# EAGLE design adafruit flora mainboard (EAGLE 6.3)
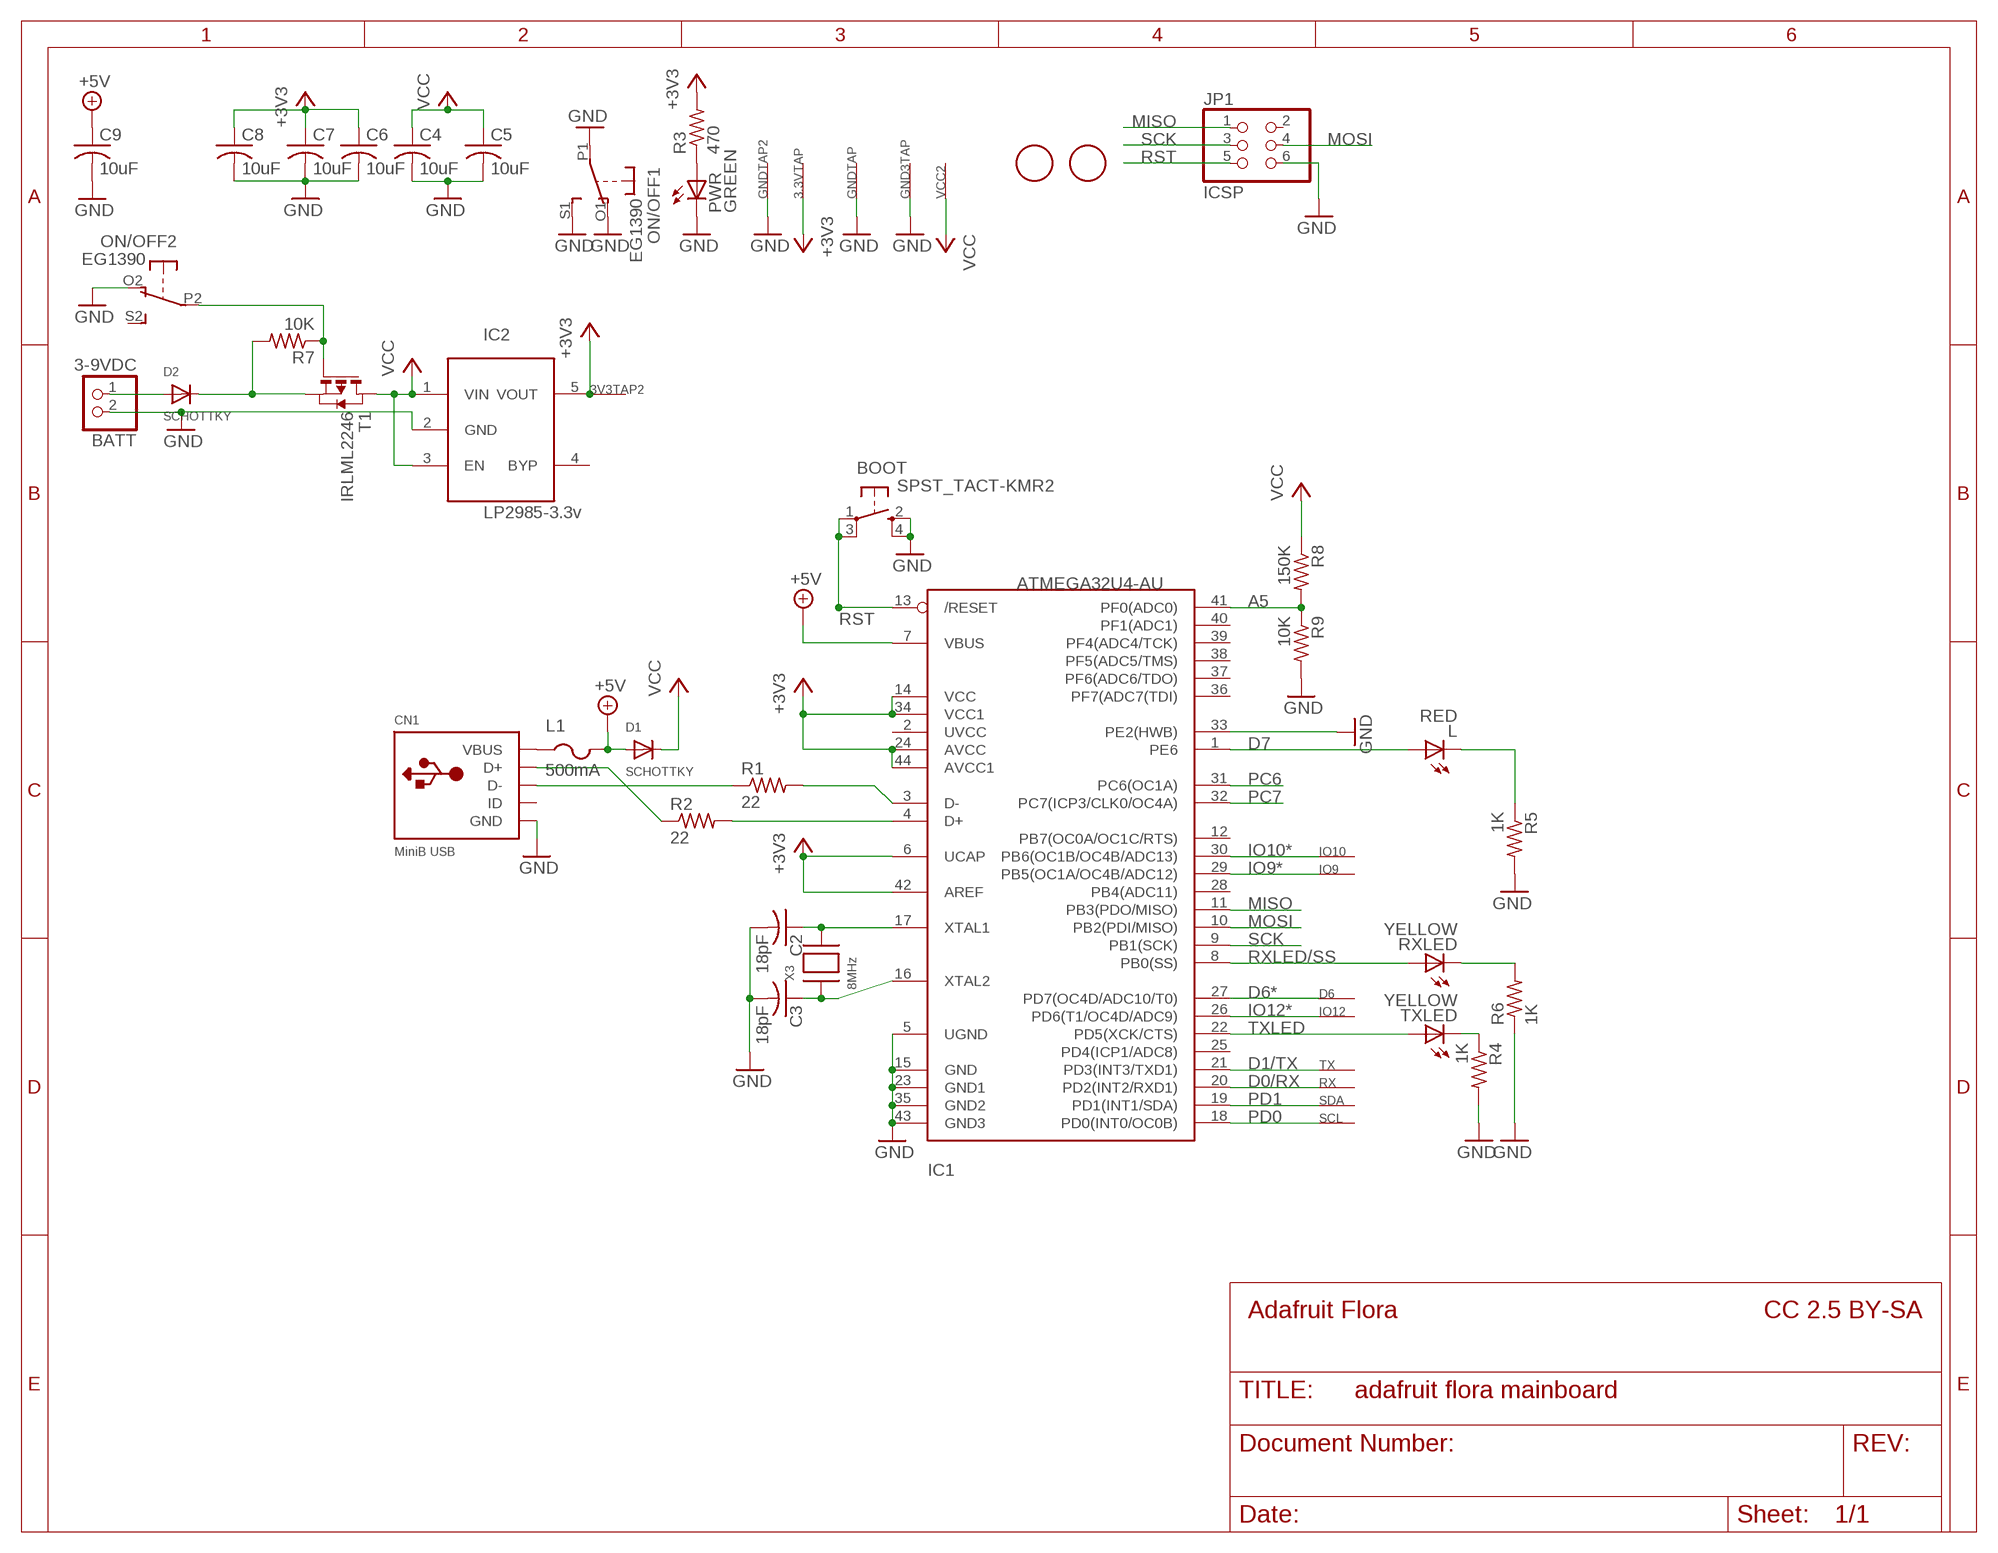
[diagram p0: schematic, sheet 1]

## Parts
3.3VTAP  SEWTAP-2.0IN  [SEWINGTAP_2.0]
3V3TAP2  SEWTAP-2.0IN  [SEWINGTAP_2.0]
BATT  3-9VDC  JST_2PIN-SMT-RA  [JST-PH-2-SMT-RA]
BOOT  SPST_TACT-KMR2  [KMR2]
C2  18pF  C-USC0805K  [C0805K]
C3  18pF  C-USC0805K  [C0805K]
C4  10uF  C-USC0805K  [C0805K]
C5  10uF  C-USC0805K  [C0805K]
C6  10uF  C-USC0805K  [C0805K]
C7  10uF  C-USC0805K  [C0805K]
C8  10uF  C-USC0805K  [C0805K]
C9  10uF  C-USC0805K  [C0805K]
CN1  MiniB USB  USBMINIBLARGE  [USB-MINIB_LARGER]
D1  SCHOTTKY  DIODESOD-123  [SOD-123]
D2  SCHOTTKY  DIODESOD-123  [SOD-123]
D6  SEWTAP-2.0IN  [SEWINGTAP_2.0]
GND3TAP  SEWTAP-2.0IN  [SEWINGTAP_2.0]
GNDTAP  SEWTAP-2.0IN  [SEWINGTAP_2.0]
GNDTAP2  SEWTAP-2.0IN  [SEWINGTAP_2.0]
IC1  ATMEGA32U4-AU  [TQFP44]
IC2  LP2985-3.3v  LP298XS  [SOT23-5L]
IO9  SEWTAP-2.0IN  [SEWINGTAP_2.0]
IO10  SEWTAP-2.0IN  [SEWINGTAP_2.0]
IO12  SEWTAP-2.0IN  [SEWINGTAP_2.0]
JP1  ICSP  PINHD-2X3  [2X03]
L  RED  LEDCHIPLED_0805  [CHIPLED_0805]
L1  500mA  PTCFUSE-1206  [R1206]
ON/OFF  EG1390  DPDT-EG1390  [EG1390]
PWR  GREEN  LEDCHIPLED_0805  [CHIPLED_0805]
R1  22  R-US_R0805  [R0805]
R2  22  R-US_R0805  [R0805]
R3  470  R-US_R0805  [R0805]
R4  1K  R-US_R0805  [R0805]
R5  1K  R-US_R0805  [R0805]
R6  1K  R-US_R0805  [R0805]
R7  10K  R-US_R0805  [R0805]
R8  150K  R-US_R0805  [R0805]
R9  10K  R-US_R0805  [R0805]
RX  SEWTAP-2.0IN  [SEWINGTAP_2.0]
RXLED  YELLOW  LEDCHIPLED_0805  [CHIPLED_0805]
SCL  SEWTAP-2.0IN  [SEWINGTAP_2.0]
SDA  SEWTAP-2.0IN  [SEWINGTAP_2.0]
T1  IRLML2246  PMOSSOT23  [SOT-23]
TX  SEWTAP-2.0IN  [SEWINGTAP_2.0]
TXLED  YELLOW  LEDCHIPLED_0805  [CHIPLED_0805]
U$2  FIDUCIAL  [FIDUCIAL_1MM]
U$6  FIDUCIAL  [FIDUCIAL_1MM]
VCC2  SEWTAP-2.0IN  [SEWINGTAP_2.0]
X3  8MHz  XTALNX5032  [NX5032]

## Nets
+3V3: 3.3VTAP.P$1(SEW) 3V3TAP2.P$1(SEW) C6.1 C7.1 C8.1 IC1.6(UCAP) IC1.14(VCC) IC1.24(AVCC) IC1.34(VCC1) IC1.42(AREF) IC1.44(AVCC1) IC2.5(VOUT) R3.2
+5V: C9.1 D1.A IC1.7(VBUS) L1.2
A5: IC1.41(PF0(ADC0)) R8.2 R9.1
D0/RX: IC1.20(PD2(INT2/RXD1)) RX.P$1(SEW)
D1/TX: IC1.21(PD3(INT3/TXD1)) TX.P$1(SEW)
D6*: D6.P$1(SEW) IC1.27(PD7(OC4D/ADC10/T0))
D7: IC1.1(PE6) L.A
GND: BATT.2 BOOT.2(S) BOOT.4(S1) C2.2 C3.2 C4.2 C5.2 C6.2 C7.2 C8.2 C9.2 CN1.GND GND3TAP.P$1(SEW) GNDTAP2.P$1(SEW) GNDTAP.P$1(SEW) IC1.5(UGND) IC1.15(GND) IC1.23(GND1) IC1.33(PE2(HWB)) IC1.35(GND2) IC1.43(GND3) IC2.2(GND) JP1.6 ON/OFF.O1(1:O) ON/OFF.O2(2:O) ON/OFF.P1(1:P) ON/OFF.S1(1:S) PWR.C R4.2 R5.2 R6.1 R9.2
IO9*: IC1.29(PB5(OC1A/OC4B/ADC12)) IO9.P$1(SEW)
IO10*: IC1.30(PB6(OC1B/OC4B/ADC13)) IO10.P$1(SEW)
IO12*: IC1.26(PD6(T1/OC4D/ADC9)) IO12.P$1(SEW)
MISO: IC1.11(PB3(PDO/MISO)) JP1.1
MOSI: IC1.10(PB2(PDI/MISO)) JP1.4
N$1: PWR.A R3.1
N$2: CN1.D+ R2.1
N$3: IC1.3(D-) R1.2
N$4: IC1.4(D+) R2.2
N$5: CN1.D- R1.1
N$6: D2.C R7.2 T1.2(S)
N$7: BATT.1 D2.A
N$8: C2.1 IC1.17(XTAL1) X3.P$2
N$9: C3.1 IC1.16(XTAL2) X3.P$1
N$10: L.C R5.1
N$11: R4.1 TXLED.C
N$12: R6.2 RXLED.C
N$13: ON/OFF.P2(2:P) R7.1 T1.3(G)
PC6: IC1.31(PC6(OC1A))
PC7: IC1.32(PC7(ICP3/CLK0/OC4A))
PD0: IC1.18(PD0(INT0/OC0B)) SCL.P$1(SEW)
PD1: IC1.19(PD1(INT1/SDA)) SDA.P$1(SEW)
RST: BOOT.1(P) BOOT.3(P1) IC1.13(/RESET) JP1.5
RXLED/SS: IC1.8(PB0(SS)) RXLED.A
SCK: IC1.9(PB1(SCK)) JP1.3
TXLED: IC1.22(PD5(XCK/CTS)) TXLED.A
VBUS: CN1.VBUS L1.1
VCC: C4.1 C5.1 D1.C IC2.1(VIN) IC2.3(EN) R8.1 T1.1(D) VCC2.P$1(SEW)
Unconnected: CN1.ID IC1.2(UVCC) IC1.12(PB7(OC0A/OC1C/RTS)) IC1.25(PD4(ICP1/ADC8)) IC1.28(PB4(ADC11)) IC1.36(PF7(ADC7(TDI)) IC1.37(PF6(ADC6/TDO)) IC1.38(PF5(ADC5/TMS)) IC1.39(PF4(ADC4/TCK)) IC1.40(PF1(ADC1)) IC2.4(BYP) JP1.2 ON/OFF.S2(2:S)

## Notes on the sheet
- Adafruit Flora | CC 2.5 BY-SA

## Library data of the parts
3.3VTAP 3V3TAP2 D6 GND3TAP GNDTAP GNDTAP2 IO9 IO10 IO12 RX SCL SDA TX VCC2 = adafruit:SEWTAP
BATT = adafruit:JST_2PIN: JST 2-Pin Connectors of various flavors SMT-RA (S2B-PH-SM4) 4UConnector #17311 SMT (B2B-PH-SM4) THM-RA (S2B-PH) THM (B2B-PH)
BOOT = adafruit:SPST_TACT: SMT 6mm switch, EVQQ2 series http://www.ladyada.net/library/eagle
C2-C9 = adafruit:C-US: CAPACITOR, American symbol
CN1 = microbuilder:USB: USB Connectors USBMINIB - Surface Mount Female Mini-B USB Connector 4UConnector: 06564
D1 D2 = adafruit:DIODE: Diode SMADIODE - SMA Surface Mount Package 20V 1A Schottky Diode Digikey: 641-1014-6-ND DO-1N4148 - Through Hole Small Current Diode SOD-123 20V 1 A (.5mV Vf) Schottky Diode - Digikey: MBRX120TPMSCT-ND SOD-323 10V 570mA (.38mV Vf, 3ns) Schottky Diode - Digikey: ZLLS410CT-ND SOD-523 30V 30mA Schottky Diode (RB751S-40TE61) - Digikey: RB751S-40TE61CT-ND SOT23-R/W - SOT23 Package (R = Solder Paste/Reflow Ovens, W = Hand-Soldering) BAT54Film 40V 300mA - Digikey: 497-7162-1-ND
IC1 = adaprog:ATMEGA32U4
IC2 = adafruit:LP298X
JP1 = pinhead:PINHD-2X3: PIN HEADER
L PWR RXLED TXLED = adafruit:LED: LED OSRAM: - CHIPLED LG R971, LG N971, LY N971, LG Q971, LY Q971, LO R971, LY R971 LH N974, LH R974 LS Q976, LO Q976, LY Q976 LO Q996 - Hyper CHIPLED LW Q18S LB Q993, LB Q99A, LB R99A - SideLED LS A670, LO A670, LY A670, LG A670, LP A670 LB A673, LV A673, LT A673, LW A673 LH A674 LY A675 LS A676, LA A676, LO A676, LY A676, LW A676 LS A679, LY A679, LG A679 - Hyper Micro SIDELED® LS Y876, LA Y876, LO Y876, LY Y876 LT Y87S - SmartLED LW L88C, LW L88S LB L89C, LB L89S, LG L890 LS L89K, LO L89K, LY L89K LS L896, LA L896, LO L896, LY L896 - TOPLED LS T670, LO T670, LY T670, LG T670, LP T670 LSG T670, LSP T670, LSY T670, LOP T670, LYG T670 LG T671, LOG T671, LSG T671 LB T673, LV T673, LT T673, LW T673 LH T674 LS T676, LA T676, LO T676, LY T676, LB T676, LH T676, LSB T676, LW T676 LB T67C, LV T67C, LT T67C, LS T67K, LO T67K, LY T67K, LW E67C LS E67B, LA E67B, LO E67B, LY E67B, LB E67C, LV E67C, LT E67C LW T67C LS T679, LY T679, LG T679 LS T770, LO T770, LY T770, LG T770, LP T770 LB T773, LV T773, LT T773, LW T773 LH T774 LS E675, LA E675, LY E675, LS T675 LS T776, LA T776, LO T776, LY T776, LB T776 LHGB T686 LT T68C, LB T68C - Hyper Mini TOPLED® LB M676 - Mini TOPLED Santana® LG M470 LS M47K, LO M47K, LY M47K Source: http://www.osram.convergy.de/
L1 = adafruit:PTCFUSE: PTC fuses, resettable thermistors
ON/OFF = adafruit:DPDT
R1-R9 = adafruit:R-US_: RESISTOR, American symbol
T1 = zetex:PMOSSOT23: MOS FET
U$2 U$6 = adafruit:FIDUCIAL: For use by pick and place machines to calibrate the vision/machine, 1mm By microbuilder.eu
X3 = adaprog:XTAL

## Board
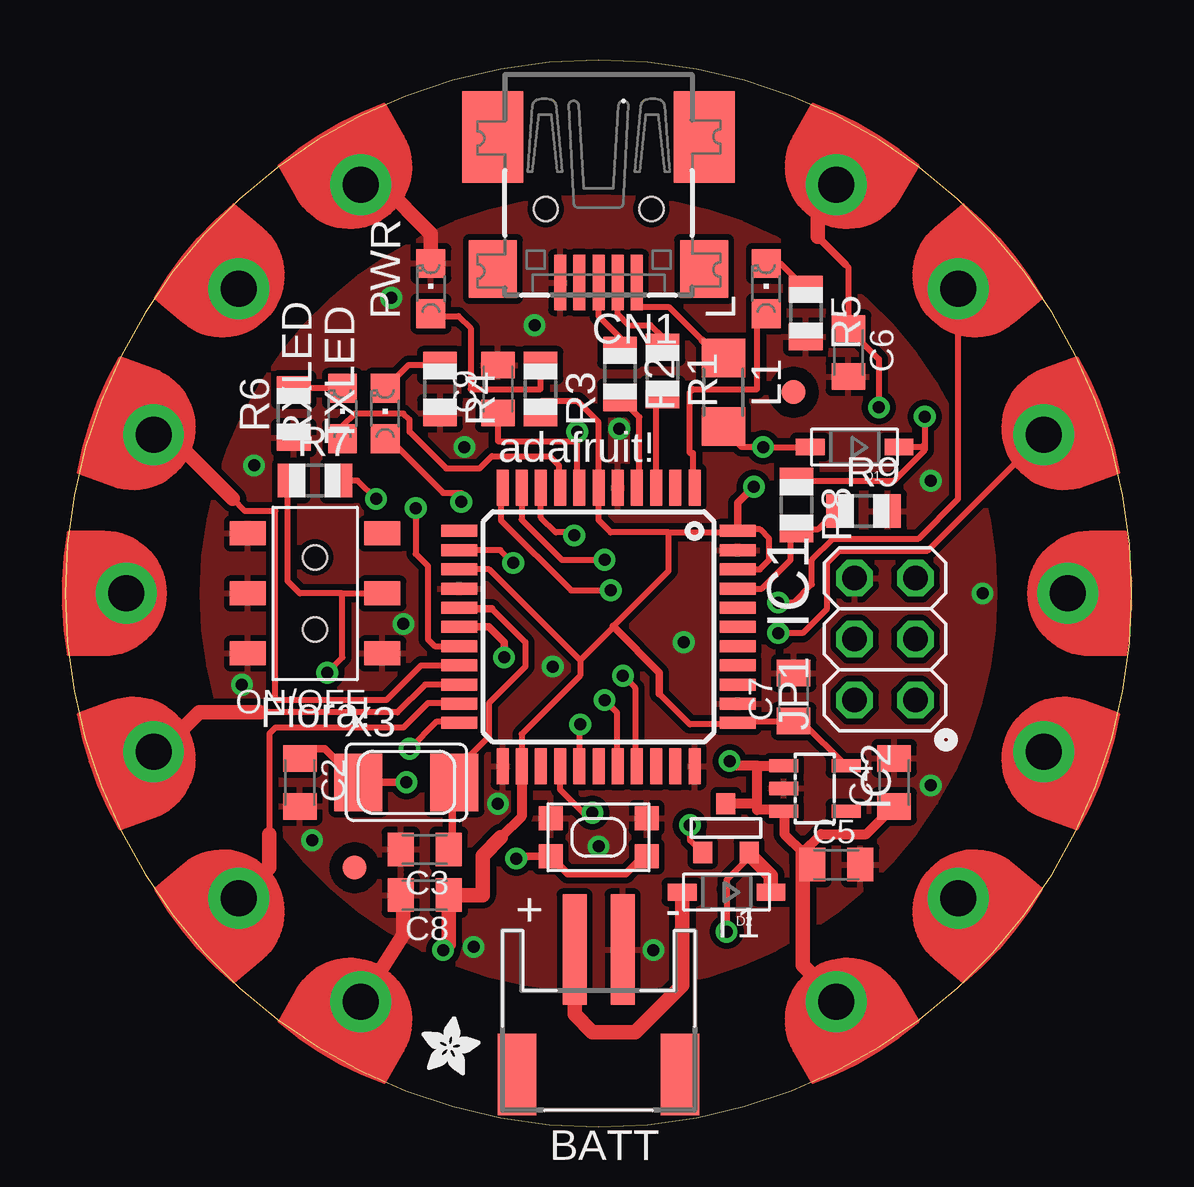
[diagram p1: board, top side]
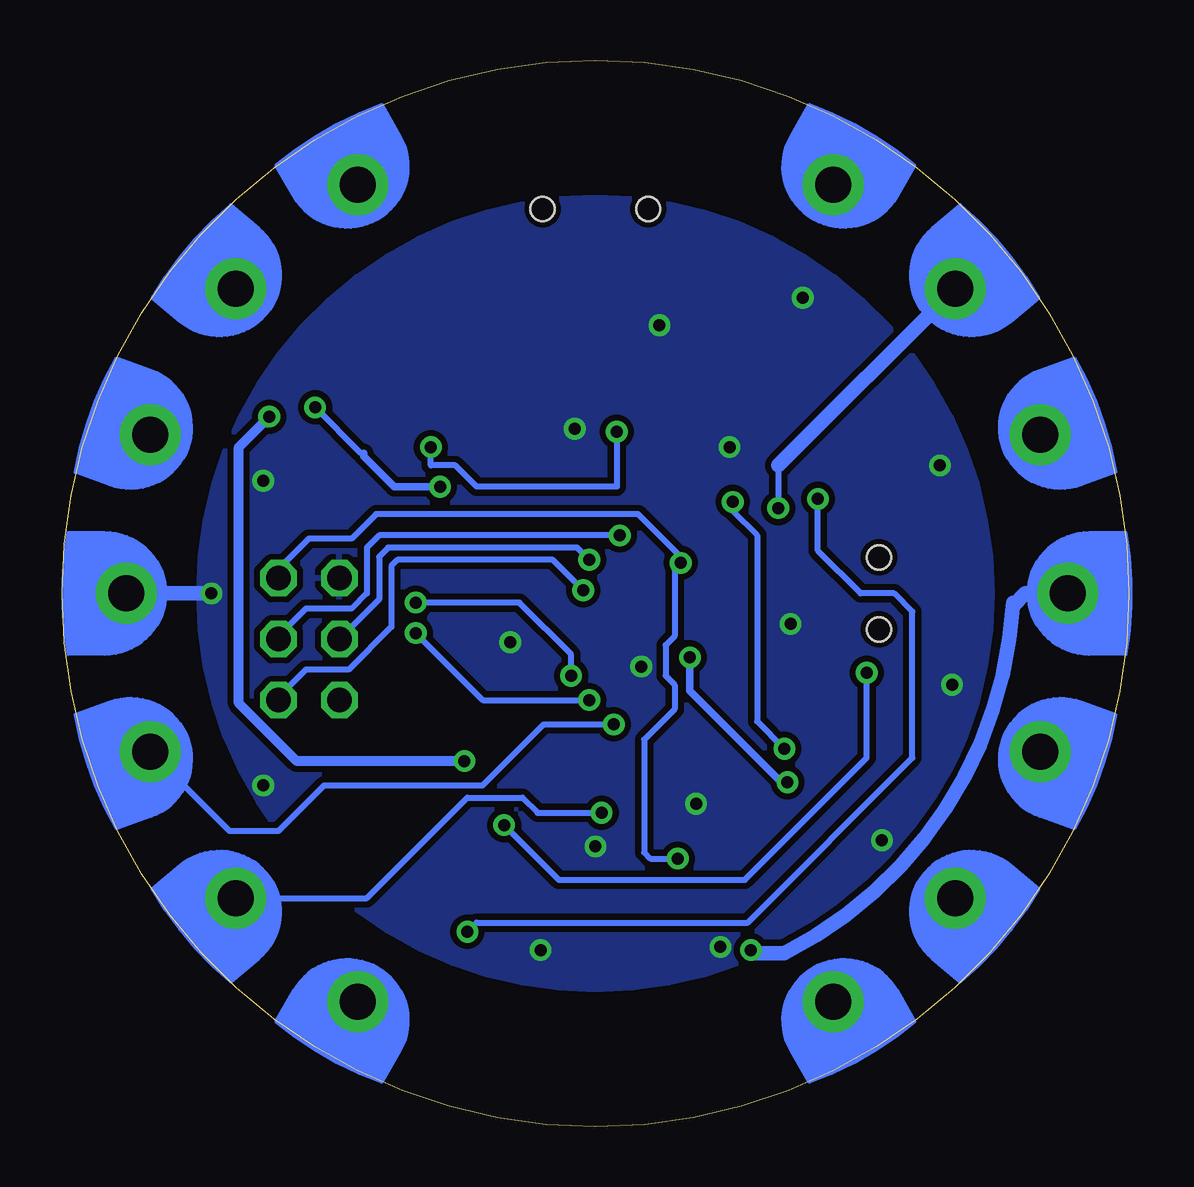
[diagram p2: board, bottom side, seen from below]

Size 44.45 x 44.45 mm. Coordinates in mm from the lower left corner, seen from the top.
Outline: 0,22.23 arc90 22.23,0 arc90 44.45,22.23 arc90 22.23,44.45 arc90 0,22.23
Copper layers (1*16): Top 0.035mm / dielectric 1.5mm / Bottom 0.035mm
Design rules "default": minimum track width 10mil, minimum drill 19mil, track to track 10mil, track to pad 10mil, pad to pad 10mil, via to via 10mil, smd to smd 8mil, copper to edge 10mil, drill to drill 8mil, minimum pad ring 10mil, minimum via ring 8mil, stop-mask expansion 4mil, vias tented up to drill 20mil, thermal gap 10mil

### Footprints (pad centres in the part's own frame; a part is rotated, then mirrored left to right if it is on the bottom)
SEWINGTAP_2.0 = drill 1.5 pad 2.54: P$1 0,0
JST-PH-2-SMT-RA = smd 1 x 4.6: 1 1,-3.7; 2 -1,-3.7 | smd 1.6 x 3.4: NC1 -3.4,1.5; NC2 3.4,1.5
KMR2 = smd 1 x 1: 1 2,0.8; 2 2,-0.8; 3 -2,0.8; 4 -2,-0.8
C0805K = smd 1.1 x 1.4: 1 -1,0; 2 1,0
USB-MINIB_LARGER = smd 0.5 x 2.308: D+ 0,4.064; D- -0.8,4.064; GND 1.6,4.064; ID 0.8,4.064; VBUS -1.6,4.064 | smd 2.54 x 3.81: GND1 -4.4,-2; GND4 4.4,-2 | smd 2 x 2.4: GND2 -4.4,3.5; GND3 4.4,3.5 | hole 1: -2.2,1; 2.2,1
SOD-123 = smd 1.2 x 0.7: A 1.85,0; C -1.85,0
TQFP44 = smd 1.5 x 0.5: 1 -5.8,4; 2 -5.8,3.2; 3 -5.8,2.4; 4 -5.8,1.6; 5 -5.8,0.8; 6 -5.8,0; 7 -5.8,-0.8; 8 -5.8,-1.6; 9 -5.8,-2.4; 10 -5.8,-3.2; 11 -5.8,-4; 23 5.8,-4; 24 5.8,-3.2; 25 5.8,-2.4; 26 5.8,-1.6; 27 5.8,-0.8; 28 5.8,0; 29 5.8,0.8; 30 5.8,1.6; 31 5.8,2.4; 32 5.8,3.2; 33 5.8,4 | smd 0.5 x 1.5: 12 -4,-5.8; 13 -3.2,-5.8; 14 -2.4,-5.8; 15 -1.6,-5.8; 16 -0.8,-5.8; 17 0,-5.8; 18 0.8,-5.8; 19 1.6,-5.8; 20 2.4,-5.8; 21 3.2,-5.8; 22 4,-5.8; 34 4,5.8; 35 3.2,5.8; 36 2.4,5.8; 37 1.6,5.8; 38 0.8,5.8; 39 0,5.8; 40 -0.8,5.8; 41 -1.6,5.8; 42 -2.4,5.8; 43 -3.2,5.8; 44 -4,5.8
SOT23-5L = smd 0.55 x 1.2: 1 -0.95,-1.3; 2 0,-1.3; 3 0.95,-1.3; 4 0.95,1.3; 5 -0.95,1.3
2X03 = drill 1.016 octagon: 1 -2.54,-1.27; 2 -2.54,1.27; 3 0,-1.27; 4 0,1.27; 5 2.54,-1.27; 6 2.54,1.27
CHIPLED_0805 = smd 1.2 x 1.2: A 0,-1.05; C 0,1.05
R1206 = smd 1.6 x 1.803: 1 -1.422,0; 2 1.422,0
EG1390 = smd 1 x 1.5: O1 -2.5,2.8; O2 -2.5,-2.8; P1 0,2.8; P2 0,-2.8; S1 2.5,2.8; S2 2.5,-2.8 | hole 1: 1.5,0; -1.5,0
R0805 = smd 1.1 x 1.4: 1 -1,0; 2 1,0
SOT-23 = smd 0.787 x 0.889: 1 0.025,-1.016; 2 -0.94,1.016; 3 0.991,1.016
FIDUCIAL_1MM = smd 1 x 1: 1 0,0
NX5032 = smd 2 x 2.4: P$1 2,0; P$2 -2,0

### Placement (x,y rotation side)
3.3VTAP  2.54,22.23 90 top
3V3TAP2  32.13,39.24 330 top
BATT  22.23,3.68 180 top
BOOT  22.23,12.07 180 top
C2  9.78,14.35 270 top
C3  14.99,11.56 180 top
C4  34.54,14.35 90 top
C5  32.13,10.92 0 top
C6  32.64,32.26 270 top
C7  30.35,17.91 90 top
C8  14.99,9.65 180 top
C9  18.03,30.73 90 top
CN1  22.23,39.24 180 top
D1  32.89,28.32 180 top
D2  27.56,9.78 180 top
D6  40.77,15.62 250 top
GND3TAP  12.32,39.24 30 top
GNDTAP  41.78,22.23 270 top
GNDTAP2  12.32,5.21 150 top
IC1  22.23,20.83 270 top
IC2  31.24,14.1 270 top
IO9  40.77,28.83 290 top
IO10  37.21,34.92 310 top
IO12  37.21,9.53 230 top
JP1  34.16,20.32 90 top
L  29.21,34.92 0 top
L1  27.43,30.61 270 top
ON/OFF  10.41,22.23 90 top
PWR  15.24,34.92 0 top
R1  24.89,31.5 270 top
R2  23.11,31.37 270 top
R3  19.81,30.73 270 top
R4  15.62,30.73 270 top
R5  30.86,33.91 270 top
R6  9.53,29.72 90 top
R7  10.41,26.92 0 top
R8  30.48,25.91 270 top
R9  33.27,25.65 0 top
RX  3.68,15.62 110 top
RXLED  11.56,29.72 0 top
SCL  7.24,34.92 50 top
SDA  3.68,28.83 70 top
T1  27.56,12.45 180 top
TX  7.24,9.53 130 top
TXLED  13.34,29.72 0 top
U$2  12.07,10.8 0 top
U$3  [ADAFRUIT_2.5MM]  14.86,2.16 0 top
U$4  [FLORAMED]  33.91,24.13 0 bottom
U$6  30.35,30.61 0 top
VCC2  32.13,5.21 210 top
X3  14.22,14.35 0 top

### Tracks (layer width: path | path; a pad name or v marks a point on that pad's centre or on a via)
+3V3  (via drill 0.5)
  Top 0.254: IC1.14 17.67,23.23 21.46,19.43 | IC1.24 19.03,16.36 21.46,18.8 21.46,19.43 | 24.77,18.03 26.04,16.76 28.07,16.76 | 28.07,16.76 28.03,16.81 IC1.34 28.07,16.79 28.07,16.76 | 30.35,16.89 28.32,16.89 28.19,16.76 28.07,16.76 | 19.81,29.34 R3.2 19.81,30.23 21.35,30.23 22.23,29.35 IC1.6 22.23,25.27 22.73,24.77 25.15,24.77 | 25.15,24.77 28.07,24.77 28.07,24.79 IC1.44 28.09,24.89 28.96,24.89 29.34,24.51 29.34,23.62 28.94,23.23 IC1.42 | 25.15,24.77 25.15,23.16 22.84,20.85 | 32.51,35.94 32.64,35.81 C6.1 33.91,31.99 v33.91,29.97 | IC2.5 30.68,16.91 C7.1 | 21.46,19.43 22.8,20.77 22.92,20.77
  Top 0.305: 22.84,20.85 22.92,20.77 24.77,18.92 24.77,18.03 | IC1.44 28.03,25.99 v28.7,26.67 | 32.51,35.94 31.37,37.08
  Top 0.406: 30.35,16.89 C7.1 | IC1.24 19.03,12.93 18.16,12.07
  Top 0.61: 3V3TAP2.P$1 31.37,38.48 31.37,37.08 | 16,9.67 16,9.78 | 16,9.67 C8.1 | 16,9.65 16,9.67 | 18.16,12.07 17.4,11.3 17.4,9.65 16,9.65 | 16,9.65 C8.1 | v15.75,7.37 15.99,7.6 C8.1
  Bottom 0.254: v33.91,29.97 32,28.07 31.88,28.07
  Bottom 0.305: v28.7,26.67 30.61,26.67 31.88,27.94 31.88,28.07
  Bottom 0.61: 3.3VTAP.P$1 4.32,22.23 4.83,21.72 4.83,21.84 arc60 14.35,7.24 15.75,7.24 v15.75,7.37
+5V  (via drill 0.5)
  Top 0.254: L1.2 27.43,29.08 28.19,28.32 v29.08,28.32 D1.A 31.5,28.32 | C9.1 18.03,28.58 21.34,28.58 v21.34,28.96 21.34,26.63 IC1.7
  Bottom 0.254: v29.08,28.32 29.08,27.56 28.07,27.56 27.18,26.67 21.34,26.67 v21.34,28.96
A5
  Top 0.254: IC1.41 29.03,22.43 30.23,23.62 30.23,24.89 | R9.1 32.13,25.65 31.39,24.91 R8.2
  Top 0.305: R8.2 30.46,24.89 30.23,24.89
D0/RX
  Top 0.254: IC1.20 15,18.43 13.84,17.27 8.13,17.27
  Top 0.61: RX.P$1 3.81,15.49 5.59,17.27 8.13,17.27
D1/TX
  Top 0.254: 8.51,12.19 8.51,16.38 8.76,16.64 14.1,16.64 15.11,17.65 16.38,17.65 16.41,17.63 IC1.21
  Top 0.61: 8.51,12.19 8.51,10.8 TX.P$1
D6*  (via drill 0.5)
  Top 0.254: IC1.27 21.43,16.8 v21.46,16.76
  Bottom 0.254: v21.46,16.76 24.38,16.76 26.92,14.22 33.53,14.22 35.43,12.32 37.47,12.32 D6.P$1 40.89,15.62
D7
  Top 0.254: IC1.1 26.18,26.67 26.16,26.67 26.16,28.07 26.04,28.07 26.04,30.61 26.16,30.73 28.83,30.73 28.83,33.49 L.A
  Top 0.406: L.A 29.17,33.88
GND  (via drill 0.5)
  Top 0.61: GNDTAP2.P$1 14.1,8 14.1,9.65 C8.2 | GND3TAP.P$1 13.21,39.24 15.24,37.21 PWR.C
  Bottom 0.61: 38.48,22.23 GNDTAP.P$1
  other vias: 7.87,27.56 10.29,11.94 17.02,7.49 20.32,19.18 13.59,34.54 38.23,22.23 36.07,14.22 25.78,20.19 36.07,26.92 16.64,28.32 19.56,33.4 14.1,20.96 7.37,18.42 18.03,13.46 22.23,11.68 24.51,7.37 23.09,29.08
  pour Top: 22.23,5.71 arc90 38.73,22.23 arc90 22.23,38.73 arc90 5.71,22.23 arc90
  pour Bottom: 22.23,5.71 arc90 38.73,22.23 arc90 22.23,38.73 arc90 5.71,22.23 arc90
IO9*  (via drill 0.5)
  Top 0.254: IO9.P$1 35.94,24 32.26,24 31.75,23.5 31.75,21.59 30.73,20.57 v29.72,20.57 | 22.99,14.99 22.99,14.86 | 22.99,14.99 IC1.29 | v22.48,17.78 22.99,17.27 22.99,14.99
  Bottom 0.254: v29.72,20.57 26.92,17.78 v22.48,17.78
IO10*  (via drill 0.5)
  Top 0.254: IO10.P$1 37.21,26.16 35.56,24.51 32,24.51 31.12,23.62 31.12,22.61 30.35,21.84 v29.72,21.84 | IC1.30 23.75,15.1 23.75,18.29 v23.24,18.8
  Bottom 0.254: v29.72,21.84 25.4,21.84 23.24,19.69 v23.24,18.8
IO12*  (via drill 0.5)
  Top 0.254: IC1.26 20.62,14.05 21.59,13.08 v21.97,13.08
  Bottom 0.254: v21.97,13.08 24.64,13.08 25.27,13.72 27.56,13.72 31.75,9.53 IO12.P$1
MISO  (via drill 0.5)
  Top 0.254: IC1.11 18.18,26.67 18.16,26.67 18.16,25.27 21.08,22.35 v22.73,22.35
  Bottom 0.254: JP1.1 35.43,17.91 34.29,19.05 32.51,19.05 30.73,20.83 30.73,23.37 30.48,23.62 24,23.62 v22.73,22.35
MOSI  (via drill 0.5)
  Top 0.254: IC1.10 19.03,25.3 20.7,23.62 v22.48,23.62
  Bottom 0.254: v22.48,23.62 22.99,24.13 30.86,24.13 31.24,23.75 31.24,21.97 JP1.4
N$1
  Top 0.254: 19.81,31.75 R3.1 19.81,30.73 16.89,30.73 16.89,33.27 16.38,33.78 15.24,33.78 PWR.A
N$2
  Top 0.254: CN1.D+ 22.23,33.78 23.11,32.89 R2.1
N$3
  Top 0.254: IC1.3 24.62,30.23 R1.2
N$4
  Top 0.254: 23.93,26.73 23.93,29.58 23.9,29.58 R2.2
  Top 0.305: IC1.4 23.93,26.73
N$5
  Top 0.254: CN1.D- 23.03,33.87 23.5,33.4 24.38,33.4 24.89,32.89 R1.1 24.89,32.51
N$6  (via drill 0.5)
  Top 0.254: 27.56,9.91 27.53,9.91 | 27.56,9.91 v27.56,8.13 | v12.95,26.16 12.19,26.92 R7.2 | 27.56,9.91 27.56,10.29 28.58,11.3
  Top 0.61: 29.46,9.78 D2.C 29.41,10.47 28.58,11.3 28.5,11.38 T1.2
  Bottom 0.254: v27.56,8.13 27.18,8.51 15.88,8.51 9.02,15.37 9.02,21.46 9.78,22.23 11.18,22.23 12.95,24 v12.95,26.16
N$7
  Top 0.61: BATT.1 21.23,4.68 21.97,3.94 23.75,3.94 25.71,5.9 D2.A
N$8  (via drill 0.5)
  Top 0.305: C2.1 9.78,15.75 10.83,15.75 X3.P$2 v14.22,14.35 | v18.29,19.56 18.29,20.19 17.65,20.83 IC1.17
  Bottom 0.305: v14.22,14.35 14.48,14.35 18.29,18.16 v18.29,19.56
N$9
  Top 0.254: 16.22,14.83 17.65,16.26 17.65,17.65 19.18,19.18 19.18,20.19 17.78,21.59 | 16.13,11.57 16.11,11.56 C3.1
  Top 0.305: 16.22,14.83 X3.P$1 16.13,14.26 16.13,11.57 | IC1.16 16.47,21.63 16.51,21.59 17.78,21.59
N$10
  Top 0.254: L.C 29.8,35.98 R5.1
N$11
  Top 0.254: 13.37,30.73 TXLED.C 14.32,31.75 15.62,31.75 R4.1
N$12
  Top 0.254: RXLED.C 9.56,30.77
  Top 0.305: R6.2 9.53,30.73 9.56,30.77
N$13  (via drill 0.5)
  Top 0.254: 9.27,26.3 9.27,22.73 9.78,22.23 11.56,22.23 | 11.56,22.23 12.7,22.23 | 11.56,22.23 11.56,19.56 v10.92,18.92 | T1.3 26.54,11.43 26.04,11.94 v26.04,12.57
  Top 0.305: 9.27,26.3 9.41,26.45 R7.1
  Top 0.406: 12.7,22.23 ON/OFF.P2
  Bottom 0.254: v26.04,12.57 23.75,10.29 16,10.29 10.92,15.37 v10.92,18.92
PD0  (via drill 0.5)
  Top 0.254: IC1.18 15.41,20.03 15.11,20.32 15.11,23.37 14.61,23.88 v14.61,25.78
  Bottom 0.254: 14.61,27.56 v14.61,25.78
  Bottom 0.61: SCL.P$1 14.61,27.56
PD1
  Top 0.254: 6.99,26.16 7.49,25.65 8.76,25.65 8.76,17.78 13.39,17.78 14.83,19.23 IC1.19
  Top 0.61: SDA.P$1 3.68,28.7 4.45,28.7 6.99,26.16
RST  (via drill 0.5)
  Top 0.254: IC1.13 18.14,24.03 v18.67,23.5 | v18.8,11.18 18.92,11.3
  Top 0.305: BOOT.1 20.95,10.54 23.37,10.54 24.09,11.27 BOOT.3 24.26,11.27 24.26,11.18 | BOOT.1 20.07,11.27 | BOOT.1 18.8,11.27 v18.8,11.18
  Top 0.406: 20.07,11.27 20.07,11.43
  Bottom 0.254: JP1.5 35.56,22.73 35.56,23.11 34.16,24.51 32.39,24.51 31.37,25.53 20.45,25.53 18.67,23.75 v18.67,23.5 18.92,23.24 18.92,20.45 19.3,20.07 19.3,18.8 18.92,18.42 18.92,17.4 20.19,16.13 20.19,11.43 19.94,11.18 v18.8,11.18
RXLED/SS
  Top 0.254: 20.57,26.68 20.57,27.56 20.19,27.94 17.78,27.94 17.27,27.43 15.88,27.43 14.35,28.96 14.35,29.46 14.1,29.72 12.07,29.72 11.56,29.21 RXLED.A
  Top 0.305: 20.57,26.68 IC1.8
SCK  (via drill 0.5)
  Top 0.254: IC1.9 19.83,25.39 20.45,24.77 21.08,24.77 v21.21,24.64
  Bottom 0.254: v21.21,24.64 31.24,24.64 31.75,24.13 31.75,23.11 31.75,22.23 32.39,21.59 34.29,21.59 35.43,20.45 JP1.3
TXLED  (via drill 0.5)
  Top 0.254: TXLED.A 13.5,28.67 | v16.51,26.04 16.51,26.42 15.75,26.42 13.5,28.67 | 13.5,28.67 13.46,28.7 | IC1.22 16.38,16.87 16.38,16.89 15.49,16.89 v14.35,15.75
  Bottom 0.254: v16.51,26.04 16.51,25.65 15.49,24.64 15.49,16.89 v14.35,15.75
VBUS
  Top 0.254: CN1.VBUS 23.83,34.16 25.15,34.16 26.54,32.77
  Top 0.305: L1.1 27.43,31.88 26.54,32.77
VCC  (via drill 0.5)
  Top 0.254: R8.1 34.53,26.91 35.81,28.19 35.81,28.45 | v35.81,29.59 35.81,28.45 | D1.C 35.69,28.32 35.81,28.45 | C5.1 31,11.05 30.73,11.05 | 29.97,13.21 29.94,13.18 IC2.3
  Top 0.406: 28.83,15.05 27.69,15.05 v27.69,15.24 | 28.83,15.05 IC2.1 | 30.1,13.21 29.97,13.21 | 29.97,13.21 28.83,13.21 28.83,13.46 | 28.83,13.46 28.83,15.05 | C4.1 33.39,12.19 31.5,12.19 30.73,11.43 29.97,12.19 29.97,13.21 | 28.83,13.46 T1.1
  Top 0.61: VCC2.P$1 32.13,5.33 30.73,6.73 30.73,11.05 30.73,11.43
  Bottom 0.406: 35.94,29.34 35.81,29.46 v35.81,29.59 37.08,28.32 37.08,17.65 34.67,15.24 v27.69,15.24

### Text on the board
tPlace: adafruit! | Flora!
tDocu: GND | 3.3V | SCL | D7 | PWR | D10 | RX | TX | SDA | D9 | 3.3V | GND | D6 | RX | D12 | TX | VBATT | GND
bDocu: Mainboard version 1.0 | Atmega32u4 @ 8 MHz | VBatt: 3-9VDC